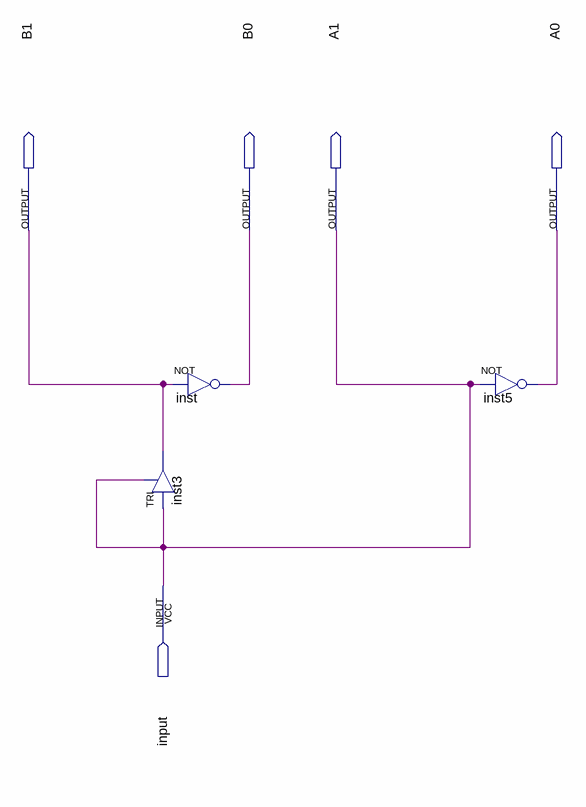
[diagram p0: schematic sheet]
// Quartus schematic x1_1_2.bdf as structural Verilog: 3 symbols, 5 pins
module x1_1_2 (
  input  \input ,
  output B1,
  output B0,
  output A1,
  output A0
);

  not inst (B0, B1);
  TRI inst3 (.IN(\input ), .OE(\input ), .OUT(B1));
  not inst5 (A0, \input );

  assign A1 = \input ;
endmodule
